# Altium project PUE_Project.PrjPcb
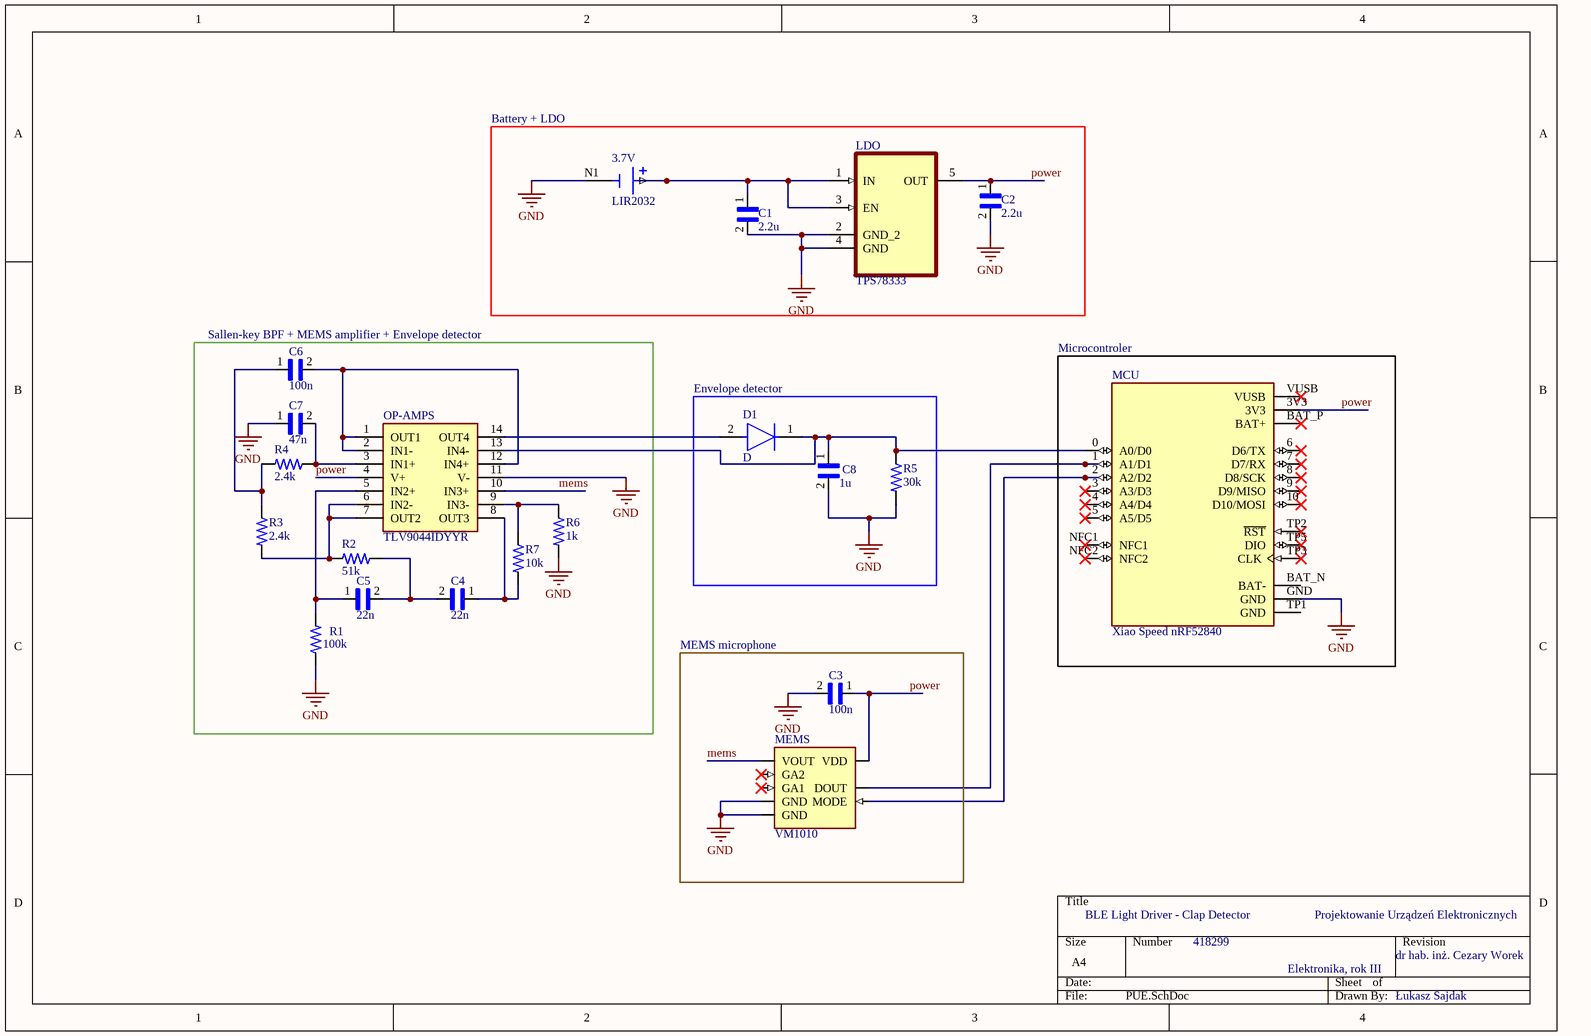
[diagram p0: PUE.SchDoc]
1 sheet, 21 parts. Net scope: global (net labels, ports and power ports of the same name join across sheets).
Board file: PCB.PcbDoc

## Sheet PUE.SchDoc: BLE Light driver
size A4; Author: Łukasz Sajdak; CompanyName: AGH University of Krakow; SheetNumber: 1; SheetTotal: 1

### Parts
3.7V  LIR2032  [BAT_BAT-HLD-001]
C1  2.2u  [CAPC2012X135N]
C2  2.2u  [CAPC2012X135N]
C3  100n  [CAPC2012X135N]
C4  22n  [CAPC2012X135N]
C5  22n  [CAPC2012X135N]
C6  100n  [CAPC2012X135N]
C7  47n  [CAPC2012X135N]
C8  1u  [CAPC2012X135N]
D1  D  [FP-017AG-MFG]
LDO  TPS78333  [SOT95P280X110-5N]
MCU  Xiao Speed nRF52840  [MODULE_102010448]
MEMS  VM1010  [VM1010]
OP-AMPS  TLV9044IDYYR  [SOP50P326X110-14N]
R1  100k  [RESC2012X65N]
R2  51k  [RESC2012X65N]
R3  2.4k  [RESC2012X65N]
R4  2.4k  [RESC2012X65N]
R5  30k  [RESC2012X65N]
R6  1k  [RESC2012X65N]
R7  10k  [RESC2012X65N]

### Blocks framed on the sheet
Battery + LDO: 3.7V C1 C2 LDO
Sallen-key BPF + MEMS amplifier + Envelope detector: C4-C7 OP-AMPS R1-R4 R6 R7
Envelope detector: C8 D1 R5
Microcontroler: MCU
MEMS microphone: C3 MEMS

### Nets
GND: 3.7V.N1(NEG) C1.2 C2.2 C3.2 C7.1 C8.2 LDO.2(GND_2) LDO.4(GND) MCU.GND MEMS.4(GND) MEMS.8(GND) OP-AMPS.11(V-) R1.1 R5.2 R6.2
mems: MEMS.1(VOUT) OP-AMPS.10(IN3+)
power: C2.1 C3.1 LDO.5(OUT) MCU.3V3 MEMS.6(VDD) OP-AMPS.4(V+)
Net3.7V_P1: 3.7V.P1(POS) 3.7V.P2(POS) C1.1 LDO.1(IN) LDO.3(EN)
NetC4_1: C4.1 OP-AMPS.8(OUT3) R7.2
NetC4_2: C4.2 C5.2 R2.1
NetC5_1: C5.1 OP-AMPS.5(IN2+) R1.2
NetC6_1: C6.1 R3.1 R4.2
NetC6_2: C6.2 OP-AMPS.1(OUT1) OP-AMPS.2(IN1-) OP-AMPS.12(IN4+)
NetC7_2: C7.2 OP-AMPS.3(IN1+) R4.1
NetC8_1: C8.1 D1.1(C) MCU.0(A0/D0) OP-AMPS.13(IN4-) R5.1
NetD1_2: D1.2(A) OP-AMPS.14(OUT4)
NetMCU_1: MCU.1(A1/D1) MEMS.7(DOUT)
NetMCU_2: MCU.2(A2/D2) MEMS.5(MODE)
NetOP-AMPS_6: OP-AMPS.6(IN2-) OP-AMPS.7(OUT2) R2.2 R3.2
NetOP-AMPS_9: OP-AMPS.9(IN3-) R6.1 R7.1

Not connected (* = marked no-connect by the designer): MCU 3(A3/D3)* 4(A4/D4)* 5(A5/D5)* 6(D6/TX)* 7(D7/RX)* 8(D8/SCK)* 9(D9/MISO)* 10(D10/MOSI)* BAT_N(BAT-) BAT_P(BAT+)* NFC1* NFC2* TP1(GND) TP2(~{RST})* TP3(CLK)* TP5(DIO)* VUSB*; MEMS 2(GA2)* 3(GA1)*

### Notes on the sheet
- BLE Light Driver - Clap Detector
- Projektowanie Urządzeń Elektronicznych
- 418299
- Elektronika, rok III
- dr hab. inż. Cezary Worek
- Łukasz Sajdak

### Library data of the parts
3.7V = BAT-HLD-001: Holder for CR2032 and CR2025 Batteries, Surface-Mount, Bulk Packaging; MF: Linx Technologies; SnapEDA_Link: https://www.snapeda.com/parts/BAT-HLD-001/TE+Connectivity/view-part/?ref=snap; Package: None; Value: *; MP: BAT-HLD-001; Check_prices: https://www.snapeda.com/parts/BAT-HLD-001/TE+Connectivity/view-part/?ref=eda
C1-C8 = GRT21BC8YA225KE13L: CAP CER 2.2UF 35V X6S 0805; Package: None; Price: None; Value: *; MP: GRT21BC8YA225KE13L; Availability: Unavailable
D1 = CMP-07163-000046-1: DIODE GEN PURP 100V 200MA DO35; Forward Voltage: 1V; Max Power Dissipation: 500mW; Max Reverse Current: 5uA; Forward Current: 300mA; Current: 4A; Reverse Recovery Time: 4ns; Element Configuration: Single; Outside Diameter: 1.85mm; Capacitance: 4pF; Polarity: Standard; Max Forward Surge Current (Ifsm): 1A; Reverse Voltage: 100V; Output Current: 200mA; Average Rectified Current: 200mA; Diameter: 1.91mm; Max Repetitive Reverse Voltage (Vrrm): 100V; Current Rating: 200mA; Case/Package: DO-35; Lead Free: Lead Free; Number of Pins: 2; Recovery Time: 4ns; Packaging: Bulk; Contact Plating: Tin; Voltage: 100V; Mount: Through Hole; Max Surge Current: 4A; Package Quantity: 2000; Width: 1.91mm; Max Reverse Voltage (DC): 100V; Length: 4.56mm; Radiation Hardening: No; Power Dissipation: 500mW; Voltage Rating (DC): 100V; Peak Non-Repetitive Surge Current: 4A; REACH SVHC: No SVHC; Height: 4.56mm; Max Operating Temperature: 175°C; Series: -; Weight: 0.01lb; Min Operating Temperature: -65°C
LDO = TPS78326DDCT: 150-mA, nano-IQ, low-dropout voltage regulator with enable from -40Â°C to +105Â°C; MF: Texas Instruments; SnapEDA_Link: https://www.snapeda.com/parts/TPS78326DDCT/Texas+Instruments/view-part/?ref=snap; Package: SOT-23-THN-5 Texas Instruments; Value: *; MP: TPS78326DDCT; Check_prices: https://www.snapeda.com/parts/TPS78326DDCT/Texas+Instruments/view-part/?ref=eda
MCU = 102010448: - nRF52840 Transceiver; Bluetooth® 5.x Evaluation Board; MF: Seeed Technology Co., Ltd; SnapEDA_Link: https://www.snapeda.com/parts/102010448/Seeed+Technology+Co.%252C+Ltd/view-part/?ref=snap; Package: None; Value: *; MP: 102010448; Check_prices: https://www.snapeda.com/parts/102010448/Seeed+Technology+Co.%252C+Ltd/view-part/?ref=eda
MEMS = VM1010: 100 Hz ~ 10 kHz Analog Microphone Piezo MEMS Omnidirectional (-38dB Â±3dB @ 94dB SPL) Solder Pads; MF: Vesper; Value: *; SnapEDA_Link: https://www.snapeda.com/parts/VM1010/P/view-part/?ref=snap; MP: VM1010; Purchase-URL: https://pricing.snapeda.com/search/part/VM1010/?ref=eda; Check_prices: https://www.snapeda.com/parts/VM1010/P/view-part/?ref=eda; Availability: In Stock; Price: None; Package: Vesper
OP-AMPS = TLV9044IDYYR: Integrated Circuit; Manufacturer_Name: Texas Instruments; Datasheet Link: https://www.ti.com/lit/ds/symlink/tlv9041.pdf?HQS=dis-mous-null-mousermode-dsf-pf-null-wwe&ts=1678359319354&ref_url=https%253A%252F%252Fwww.mouser.com%252F; Height: 1.1mm; Manufacturer_Part_Number: TLV9044IDYYR; Mouser Part Number: 595-TLV9044IDYYR; Mouser Price/Stock: https://www.mouser.co.uk/ProductDetail/Texas-Instruments/TLV9044IDYYR?qs=Li%252BoUPsLEnuuNDuU7gcpzQ%3D%3D
R1-R7 = RP73PF2A100KBTDF: RP 2A 0.25W 100K 0.1% 25PPM 1K RL; Package: None; Price: None; Value: *; MP: RP73PF2A100KBTDF; Availability: Unavailable